# Altium schematic sheet AmplificadorRF.SchDoc
size A3
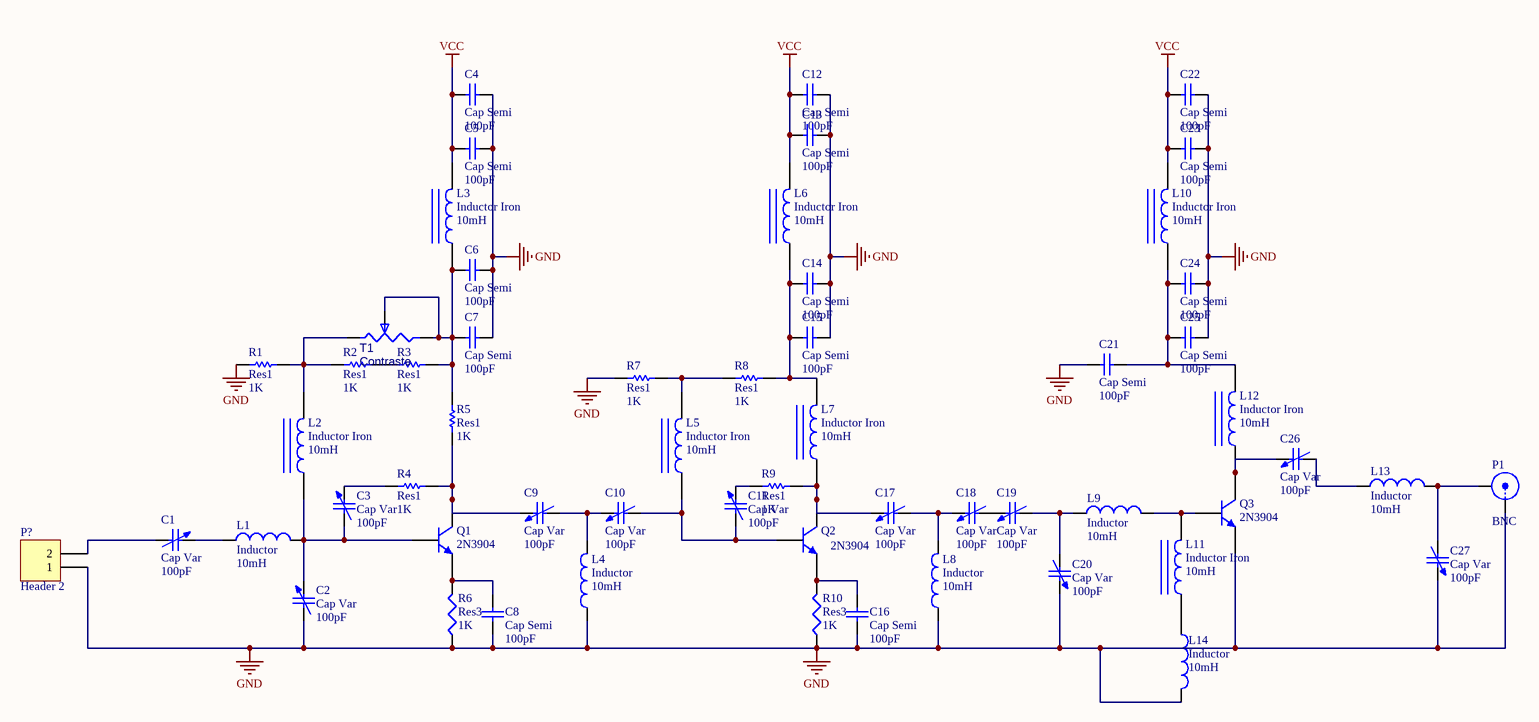
[diagram p0: AmplificadorRF.SchDoc]

## Parts
C1  Cap Var  value 100pF  [Trimer]
C2  Cap Var  value 100pF  [Trimer]
C3  Cap Var  value 100pF  [Trimer]
C4  Cap Semi  value 100pF  [C1206]
C5  Cap Semi  value 100pF  [0805]
C6  Cap Semi  value 100pF  [0805]
C7  Cap Semi  value 100pF  [C1206]
C8  Cap Semi  value 100pF  [C1206]
C9  Cap Var  value 100pF  [Trimer]
C10  Cap Var  value 100pF  [Trimer]
C11  Cap Var  value 100pF  [Trimer]
C12  Cap Semi  value 100pF  [C1206]
C13  Cap Semi  value 100pF  [0805]
C14  Cap Semi  value 100pF  [0805]
C15  Cap Semi  value 100pF  [C1206]
C16  Cap Semi  value 100pF  [C1206]
C17  Cap Var  value 100pF  [Trimer]
C18  Cap Var  value 100pF  [Trimer]
C19  Cap Var  value 100pF  [Trimer]
C20  Cap Var  value 100pF  [Trimer]
C21  Cap Semi  value 100pF  [C1206]
C22  Cap Semi  value 100pF  [C1206]
C23  Cap Semi  value 100pF  [0805]
C24  Cap Semi  value 100pF  [0805]
C25  Cap Semi  value 100pF  [C1206]
C26  Cap Var  value 100pF  [Trimer]
C27  Cap Var  value 100pF  [Trimer]
L1  Inductor  value 10mH  [AXIAL0.3]
L2  Inductor Iron  value 10mH  [VK200]
L3  Inductor Iron  value 10mH  [VK200]
L4  Inductor  value 10mH  [AXIAL0.3]
L5  Inductor Iron  value 10mH  [VK200]
L6  Inductor Iron  value 10mH  [VK200]
L7  Inductor Iron  value 10mH  [VK200]
L8  Inductor  value 10mH  [AXIAL0.3]
L9  Inductor  value 10mH  [AXIAL0.3]
L10  Inductor Iron  value 10mH  [VK200]
L11  Inductor Iron  value 10mH  [VK200]
L12  Inductor Iron  value 10mH  [VK200]
L13  Inductor  value 10mH  [AXIAL0.3]
L14  Inductor  value 10mH  [AXIAL0.3]
P1  BNC  [BNC_RA CON]
P?  Header 2  [HDR1X2]
Q1  2N3904  [TO50]
Q2  2N3904  [TO50]
Q3  2N3904  [TO-39]
R1  Res1  value 1K  [AXIAL-0.3]
R2  Res1  value 1K  [AXIAL-0.3]
R3  Res1  value 1K  [AXIAL-0.3]
R4  Res1  value 1K  [C1206]
R5  Res1  value 1K  [AXIAL-0.3]
R6  Res3  value 1K  [C1206]
R7  Res1  value 1K  [AXIAL-0.3]
R8  Res1  value 1K  [AXIAL-0.3]
R9  Res1  value 1K  [C1206]
R10  Res3  value 1K  [C1206]
T1  Contraste  [VR5]

## Nets
GND: C2.1 C4.2 C5.2 C6.2 C7.2 C8.1 C12.2 C13.2 C14.2 C15.2 C16.1 C20.2 C21.1 C22.2 C23.2 C24.2 C25.2 C27.2 L4.1 L8.1 L14.2 P1.1(X) P?.1 Q3.1(E) R1.1 R6.1 R7.1 R10.1
VCC: C4.1 C5.1 C12.1 C13.1 C22.1 C23.1 L3.2 L6.2 L10.2
NetC1_1: C1.1 P?.2
NetC1_2: C1.2 L1.1
NetC2_2: C2.2 C3.1 L1.2 L2.1 Q1.2(B)
NetC3_2: C3.2 R4.1
NetC6_1: C6.1 C7.1 L3.1 R3.2 R5.2 T1.2(TAP) T1.3(B)
NetC8_2: C8.2 Q1.1(E) R6.2
NetC9_1: C9.1 C10.2 L4.2
NetC9_2: C9.2 Q1.3(C) R4.2 R5.1
NetC10_1: C10.1 C11.1 L5.1 Q2.2(B)
NetC11_2: C11.2 R9.1
NetC14_1: C14.1 C15.1 L6.1 L7.2 R8.2
NetC16_2: C16.2 Q2.1(E) R10.2
NetC17_1: C17.1 C18.2 L8.2
NetC17_2: C17.2 L7.1 Q2.3(C) R9.2
NetC18_1: C18.1 C19.2
NetC19_1: C19.1 C20.1 L9.1
NetC21_2: C21.2 C24.1 C25.1 L10.1 L12.2
NetC26_1: C26.1 L13.1
NetC26_2: C26.2 L12.1 Q3.3(C)
NetC27_1: C27.1 L13.2 P1.2(Y)
NetL2_2: L2.2 R1.2 R2.1 T1.1(A)
NetL5_2: L5.2 R7.2 R8.1
NetL9_2: L9.2 L11.2 Q3.2(B)
NetL11_1: L11.1 L14.1
NetR2_2: R2.2 R3.1

## Library data of the parts
C1-C3 C9-C11 C17-C20 C26 C27 = Cap Var: Variable or Adjustable Capacitor; Published: 24-Mar-1999; LatestRevisionDate: 29-May-2009; LatestRevisionNote: IPC-7351 Footprint Added.; PackageReference: C1210; Publisher: Altium Limited; PackageDescription: Chip Capacitor 1210 Case Size; Code_JEITA: 1210; Code_IPC: CAPC3225
C4-C8 C12-C16 C21-C25 = Cap Semi: Capacitor (Semiconductor SIM Model); Published: 8-Jun-2000; LatestRevisionDate: 29-May-2009; LatestRevisionNote: IPC-7351 Footprint Added.; PackageReference: C1206; Publisher: Altium Limited; PackageDescription: Chip Capacitor
L1 L4 L8 L9 L13 L14 = Inductor: Code_IEC: 1005; Published: 8-Jun-2000; LatestRevisionDate: 29-May-2009; LatestRevisionNote: IPC-7351 Footprint Added.; PackageReference: 0402-A; Publisher: Altium Limited; PackageDescription: Chip Inductor; Code_JEITA: 0402
L2 L3 L5-L7 L10-L12 = Inductor Iron: Magnetic-Core Inductor; Published: 24-Mar-1999; LatestRevisionDate: 17-Jul-2002; LatestRevisionNote: Re-released for DXP Platform.; PackageReference: AXIAL-0.9; Publisher: Altium Limited; PackageDescription: Axial Device, Thru-Hole; 2 Leads; 0.9 in Pin Spacing
P1 = BNC: BNC Elbow Connector; LatestRevisionDate: 17-Jul-2002; LatestRevisionNote: Re-released for DXP Platform.; Publisher: Altium Limited
P? = Header 2: Header, 2-Pin; LatestRevisionDate: 17-Jul-2002; LatestRevisionNote: Re-released for DXP Platform.; Publisher: Altium Limited
Q1-Q3 = 2N3904: NPN General Purpose Amplifier; Published: 8-Jun-2000; LatestRevisionDate: 15-Jan-2003; LatestRevisionNote: PCB Footprint 'BCY-W3/D4.7' replaced; DatasheetVersion: 1997; PackageVersion: Sep-1998; PackageReference: TO-92A; Publisher: Altium Limited; PackageDescription: TO, Flat Index; 3 In-Line, Axial Leads; Body Dia. 4.5mm; Leads 0.51 x 0.48 mm (max); ComponentLink1Description: Manufacturer Link; ComponentLink1URL: http://www.fairchildsemi.com/; ComponentLink2Description: Datasheet; ComponentLink2URL: http://www.fairchildsemi.com/ds/2N%2F2N3904.pdf
R1-R5 R7-R9 = Res1: Resistor; Published: 8-Jun-2000; LatestRevisionDate: 17-Jul-2002; LatestRevisionNote: Re-released for DXP Platform.; PackageReference: AXIAL-0.3; Publisher: Altium Limited; PackageDescription: Axial Device, Thru-Hole; 2 Leads; 0.3 in Pin Spacing
R6 R10 = Res3: Resistor; Published: 8-Jun-2000; LatestRevisionDate: 29-May-2009; LatestRevisionNote: IPC-7351 Footprint Added.; PackageReference: J1-0603; Publisher: Altium Limited; PackageDescription: Chip Resistor
T1 = RESISTOR TAPPED: TRIMPOT AJUSTE VERT